# Altium schematic sheet node.SchDoc
size A3; SheetNumber: 1; SheetTotal: 1
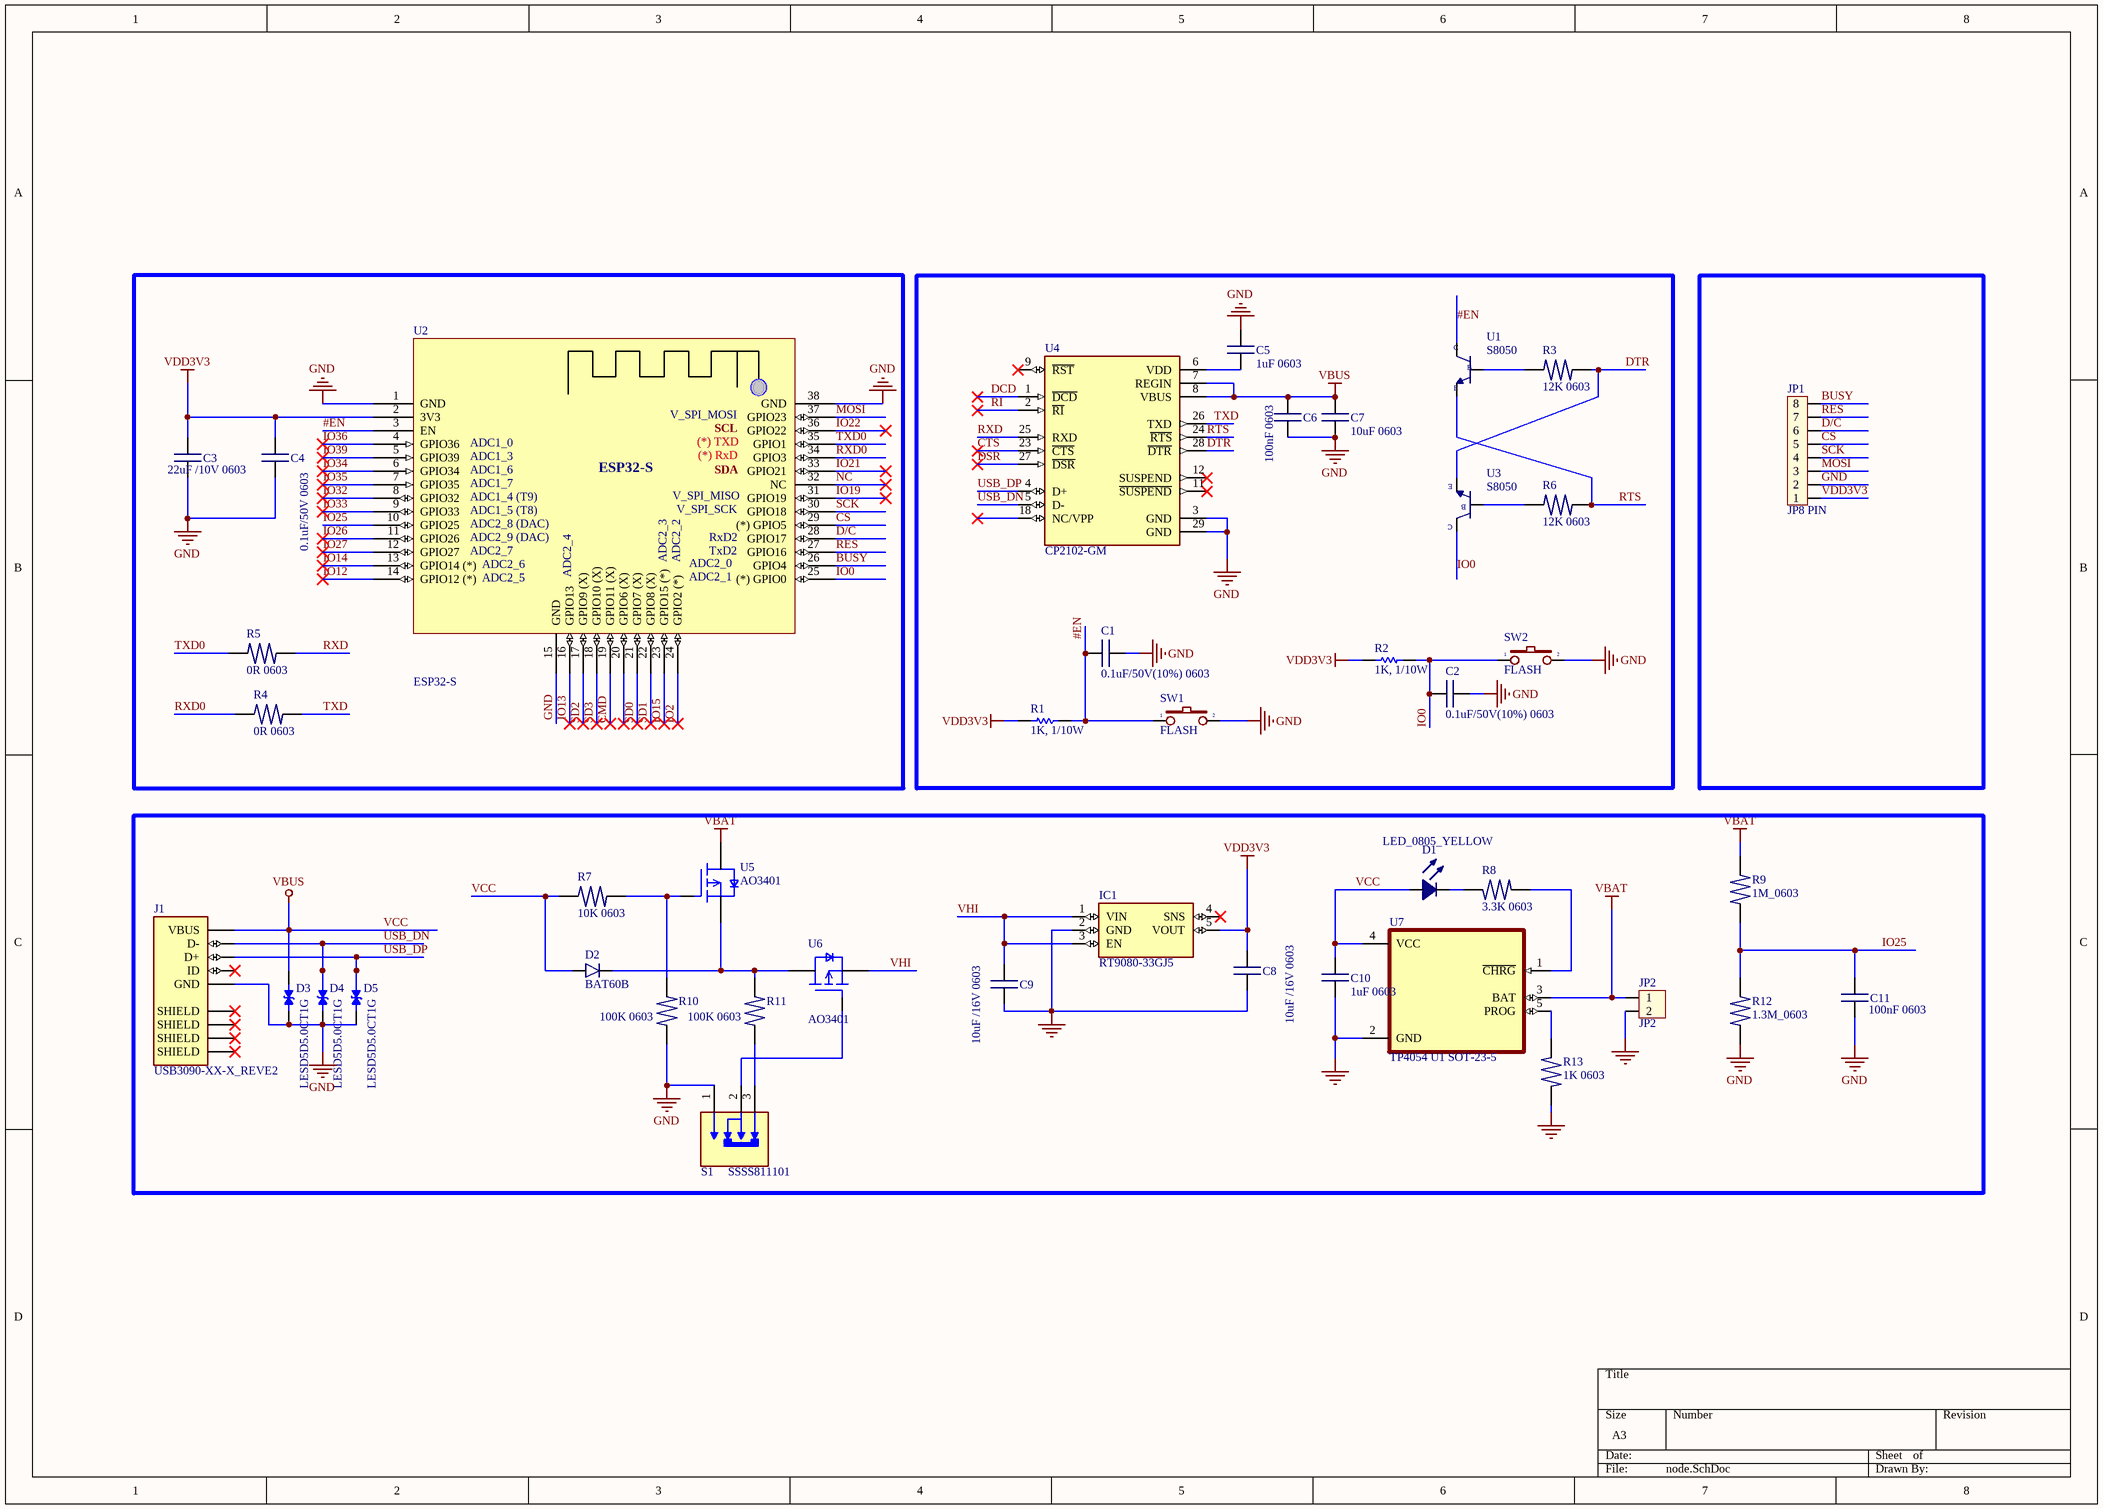
[diagram p0: node.SchDoc]

## Parts
C1  0.1uF/50V(10%) 0603  [CAPACITOR 0603]
C2  0.1uF/50V(10%) 0603  [CAPACITOR 0603]
C3  22uF /10V 0603  [CAPACITOR 0603]
C4  0.1uF/50V 0603  [CAPACITOR 0603]
C5  1uF 0603  [CAPACITOR 0603]
C6  100nF 0603  [CAPACITOR 0603]
C7  10uF 0603  [CAPACITOR 0603]
C8  10uF /16V 0603  [CAPACITOR 0603]
C9  10uF /16V 0603  [CAPACITOR 0603]
C10  1uF 0603  [CAPACITOR 0603]
C11  100nF 0603  [CAPACITOR 0603]
D1  LED_0805_YELLOW  [LED_0805_YELLOW]
D2  BAT60B  [DIODE_SMA]
D3  LESD5D5.0CT1G  [TVS_LESD5D5.0CT1G]
D4  LESD5D5.0CT1G  [TVS_LESD5D5.0CT1G]
D5  LESD5D5.0CT1G  [TVS_LESD5D5.0CT1G]
IC1  RT9080-33GJ5  [SOT94P280X100-5N]
J1  USB3090-XX-X_REVE2  [GCT_USB3090-XX-X_REVE2]
JP1  JP8 PIN  [JP8H]
JP2  JP2  [CON2]
R1  value 1K, 1/10W  [RESC1608L]  (hidden comment: CR03JL7-1K)
R2  value 1K, 1/10W  [RESC1608L]  (hidden comment: CR03JL7-1K)
R3  12K 0603  [RESISTOR_0603]
R4  0R 0603  [RESISTOR_0603]
R5  0R 0603  [RESISTOR_0603]
R6  12K 0603  [RESISTOR_0603]
R7  10K 0603  [RESISTOR_0603]
R8  3.3K 0603  [RESISTOR_0603]
R9  1M_0603  [RESISTOR_0603]
R10  100K 0603  [RESISTOR_0603]
R11  100K 0603  [RESISTOR_0603]
R12  1.3M_0603  [RESISTOR_0603]
R13  1K 0603  [RESISTOR_0603]
S1  SSSS811101  [SW_SSSS811101]
SW1  FLASH  [Button 3x4mm]
SW2  FLASH  [Button 3x4mm]
U1  S8050  [J3Y]
U2  ESP32-S  [ESP32-S]
U3  S8050  [J3Y]
U4  CP2102-GM  [QFN50P500X500X100-29N]
U5  AO3401  [SOT23-3]
U6  AO3401  [SOT23-3]
U7  TP4054 U1 SOT-23-5  [SOT95P280X100-5N]

## Nets
GND: C1.1 C2.1 C3.1 C4.2 C5.1 C6.2 C7.2 C8.1 C9.1 C10.1 C11.2 D3.1 D4.1 D5.1 IC1.2(GND) J1.5(GND) JP1.2 JP2.2 R10.1 R12.1 R13.2 S1.1 SW1.2 SW2.2 U2.1(GND) U2.15(GND) U2.38(GND) U4.3(GND) U4.29(GND) U7.2(GND)
VBAT: JP2.1 R9.2 U5.3(D) U7.3(BAT)
VCC: C6.1 C7.1 C10.2 D1.1 D2.1 D3.2 J1.1(VBUS) R7.1 U4.7(REGIN) U4.8(VBUS) U7.4(VCC)  [also labelled VBUS]
VDD3V3: C3.2 C4.1 C8.2 IC1.5(VOUT) JP1.1 R1.2 R2.2 U2.2(3V3)
#EN: C1.2 R1.1 SW1.1 U1.3(C) U2.3(EN)
BUSY: JP1.8 U2.26(GPIO4)
CMD: U2.19(GPIO11_(X))
CS: JP1.5 U2.29((*)_GPIO5)
CTS: U4.23(~{CTS})
D/C: JP1.6 U2.28(GPIO17)
DCD: U4.1(~{DCD})
DSR: U4.27(~{DSR})
DTR: R3.2 U3.2(E) U4.28(~{DTR})
IO0: C2.2 R2.1 SW2.1 U2.25((*)_GPIO0) U3.3(C)
IO2: U2.24(GPIO2_(*))
IO12: U2.14(GPIO12_(*))
IO13: U2.16(GPIO13)
IO14: U2.13(GPIO14_(*))
IO15: U2.23(GPIO15_(*))
IO19: U2.31(GPIO19)
IO21: U2.33(GPIO21)
IO22: U2.36(GPIO22)
IO25: C11.1 R9.1 R12.2 U2.10(GPIO25)
IO26: U2.11(GPIO26)
IO27: U2.12(GPIO27)
IO32: U2.8(GPIO32)
IO33: U2.9(GPIO33)
IO34: U2.6(GPIO34)
IO35: U2.7(GPIO35)
IO36: U2.4(GPIO36)
IO39: U2.5(GPIO39)
MOSI: JP1.3 U2.37(GPIO23)
NC: U2.32(NC)
RES: JP1.7 U2.27(GPIO16)
RI: U4.2(~{RI})
RTS: R6.2 U1.2(E) U4.24(~{RTS})
RXD: R5.2 U4.25(RXD)
RXD0: R4.1 U2.34(GPIO3)
SCK: JP1.4 U2.30(GPIO18)
SD0: U2.21(GPIO7_(X))
SD1: U2.22(GPIO8_(X))
SD2: U2.17(GPIO9_(X))
SD3: U2.18(GPIO10_(X))
TXD: R4.2 U4.26(TXD)
TXD0: R5.1 U2.35(GPIO1)
USB_DN: D4.2 J1.2(D-) U4.5(D-)
USB_DP: D5.2 J1.3(D+) U4.4(D+)
VHI: C9.2 IC1.1(VIN) IC1.3(EN) U6.2(S)
NetC5_2: C5.2 U4.6(VDD)
NetD1_2: D1.2 R8.1
NetD2_2: D2.2 R11.2 U5.2(S) U6.3(D)
NetR3_1: R3.1 U1.1(B)
NetR6_1: R6.1 U3.1(B)
NetR7_2: R7.2 R10.2 U5.1(G)
NetR8_2: R8.2 U7.1(~{CHRG})
NetR11_1: R11.1 S1.3
NetR13_1: R13.1 U7.5(PROG)
NetS1_2: S1.2 U6.1(G)

Not connected (* = marked no-connect by the designer): IC1 4(SNS)*; J1 4(ID)* SH1(SHIELD)* SH2(SHIELD)* SH3(SHIELD)* SH4(SHIELD)*; U2 20(GPIO6_(X))*; U4 9(~{RST})* 11(~{SUSPEND})* 12(SUSPEND)* 18(NC/VPP)*

## Notes on the sheet
- (in symbol ESP32-S) V_SPI_MOSI; SCL; ADC1_0; (*) TXD; ADC1_3; (*) RxD; ADC1_6; SDA; ADC1_7; ADC1_4 (T9); V_SPI_MISO; ADC1_5 (T8); V_SPI_SCK; ADC2_8 (DAC); ADC2_9 (DAC); RxD2; ADC2_7; TxD2; ADC2_3; ADC2_2; ADC2_6; ADC2_0; ADC2_4; ADC2_5; ADC2_1

## Library data of the parts
C1-C11 = CAPACITOR 0603: Generic Capacitor 0603, 1.6x0.8x0.9mm.
D1 = LED_0805_YELLOW: LED 0805 Yellow.; JLCPCB PN: C84261
D2 = US1M: High Efficient Recovery Rectifier 1000V 1A SMA; Mouser PN: 821-US1M; ComponentLink1Description: Datasheet; Digikey PN: 4617-US1MTR-ND; JLCPCB PN: C330229
D3-D5 = LESD5D5.0CT1G: Transient Voltage Suppressors for ESD Protection; MF: Leshan Radio Co.; Check_prices: https://www.snapeda.com/parts/LESD5D5.0CT1G/Leshan+Radio+Co./view-part/?ref=eda; Value: *; Availability: Not in stock; Package: None; SnapEDA_Link: https://www.snapeda.com/parts/LESD5D5.0CT1G/Leshan+Radio+Co./view-part/?ref=snap; MP: LESD5D5.0CT1G; Price: None
IC1 = RT9080-33GJ5: Linear Voltage Regulator IC Positive Fixed 1 Output 600mA TSOT-23-5; MF: Richtek USA; SnapEDA_Link: https://www.snapeda.com/parts/RT9080-33GJ5/Richtek+USA+Inc./view-part/?ref=snap; Package: TSOT-23 Richtek; Value: *; MP: RT9080-33GJ5; Check_prices: https://www.snapeda.com/parts/RT9080-33GJ5/Richtek+USA+Inc./view-part/?ref=eda
J1 = USB3090-XX-X_REVE2: USB - micro AB USB 2.0 Receptacle Connector 5 Position Surface Mount, Right Angle; Through Hole, 2.35mm profile, 5 Pins, Horizontal, Bottom mount; MF: Global Connector Technology; MP: USB3090-30-A; SnapEDA_Link: https://www.snapeda.com/parts/USB3090-30-A/Global+Connector+Technology/view-part/?ref=snap; Package: None; Value: *; Check_prices: https://www.snapeda.com/parts/USB3090-30-A/Global+Connector+Technology/view-part/?ref=eda
JP1 = JP8: Value: JP7
JP2 = Con2: Connector 2; Value: Connector 2
R1 R2 = CR03JL7-1K: RES CR 0603 5% 1/10W 1K; Unit Price: 0.000483; ComponentLink1Description: Datasheet; ComponentLink1URL: D:\Dropbox\Datasheets\Passive Components\Resistors\Thick Film Chip Resistor CR.pdf
R3-R13 = RESISTOR_0603: Generic Resistor 0603.
S1 = SSSS811101: Switch Slide SP Side Slide 0.3A 5VDC 10000Cycles Gull Wing SMD T/R; MF: ALPS; SnapEDA_Link: https://www.snapeda.com/parts/SSSS811101/ALPS/view-part/?ref=snap; Package: None; Value: *; MP: SSSS811101; Check_prices: https://www.snapeda.com/parts/SSSS811101/ALPS/view-part/?ref=eda
SW1 SW2 = SW2_1: Switch button 2 pin; Value: SW chip 2 pin
U1 U3 = J3Y: TRANSISTOR BIPOLAR (BJT) NPN 25V 500mA SOT-23-3; Digikey PN: 4518-S8050CT-ND; ComponentLink1Description: Datasheet; ComponentLink1URL: https://media.digikey.com/pdf/Data%20Sheets/UTD%20Semi%20PDFs/S8050.pdf; JLCPCB PN: C2828466
U4 = CP2102-GM: USB Bridge, USB to UART USB 2.0 UART Interface 28-QFN (5x5); MF: Silicon Labs; SnapEDA_Link: https://www.snapeda.com/parts/CP2102-GM/Silicon+Labs/view-part/?ref=snap; Package: QFN-28 Silicon Labs; Value: *; MP: CP2102-GM; Check_prices: https://www.snapeda.com/parts/CP2102-GM/Silicon+Labs/view-part/?ref=eda
U5 U6 = AO3401: P-Channel 30 V 4A (Ta) 1.4W (Ta) Surface Mount SOT-23-3; MF: Alpha & Omega Semiconductor; SnapEDA_Link: https://www.snapeda.com/parts/AO3401/Alpha/view-part/?ref=snap; Package: SOT-23-3 Alpha &amp; Omega Semiconductor; Value: *; MP: AO3401; Check_prices: https://www.snapeda.com/parts/AO3401/Alpha/view-part/?ref=eda
U7 = LTC4054ES5-4.2#TRMPBF: Standalone Linear Li-Ion Battery Charger with Thermal Regulation in ThinSOT; MF: Analog Devices; SnapEDA_Link: https://www.snapeda.com/parts/LTC4054ES5-4.2%23TRMPBF/Analog+Devices/view-part/?ref=snap; Package: SOT-5 Analog Devices; Value: *; MP: LTC4054ES5-4.2#TRMPBF; Check_prices: https://www.snapeda.com/parts/LTC4054ES5-4.2%23TRMPBF/Analog+Devices/view-part/?ref=eda